# EasyEDA Pro project ProProject_mp3主板_2024-08-05.epro

# Schematic Schematic1
Create Date: 2024-07-17; Page Name: P1; Project Name: mp3主板; Schematic Name: Schematic1; Update Date: 2024-07-25; Company: 嘉立创EDA; Page Size: A4; Version: V1.0
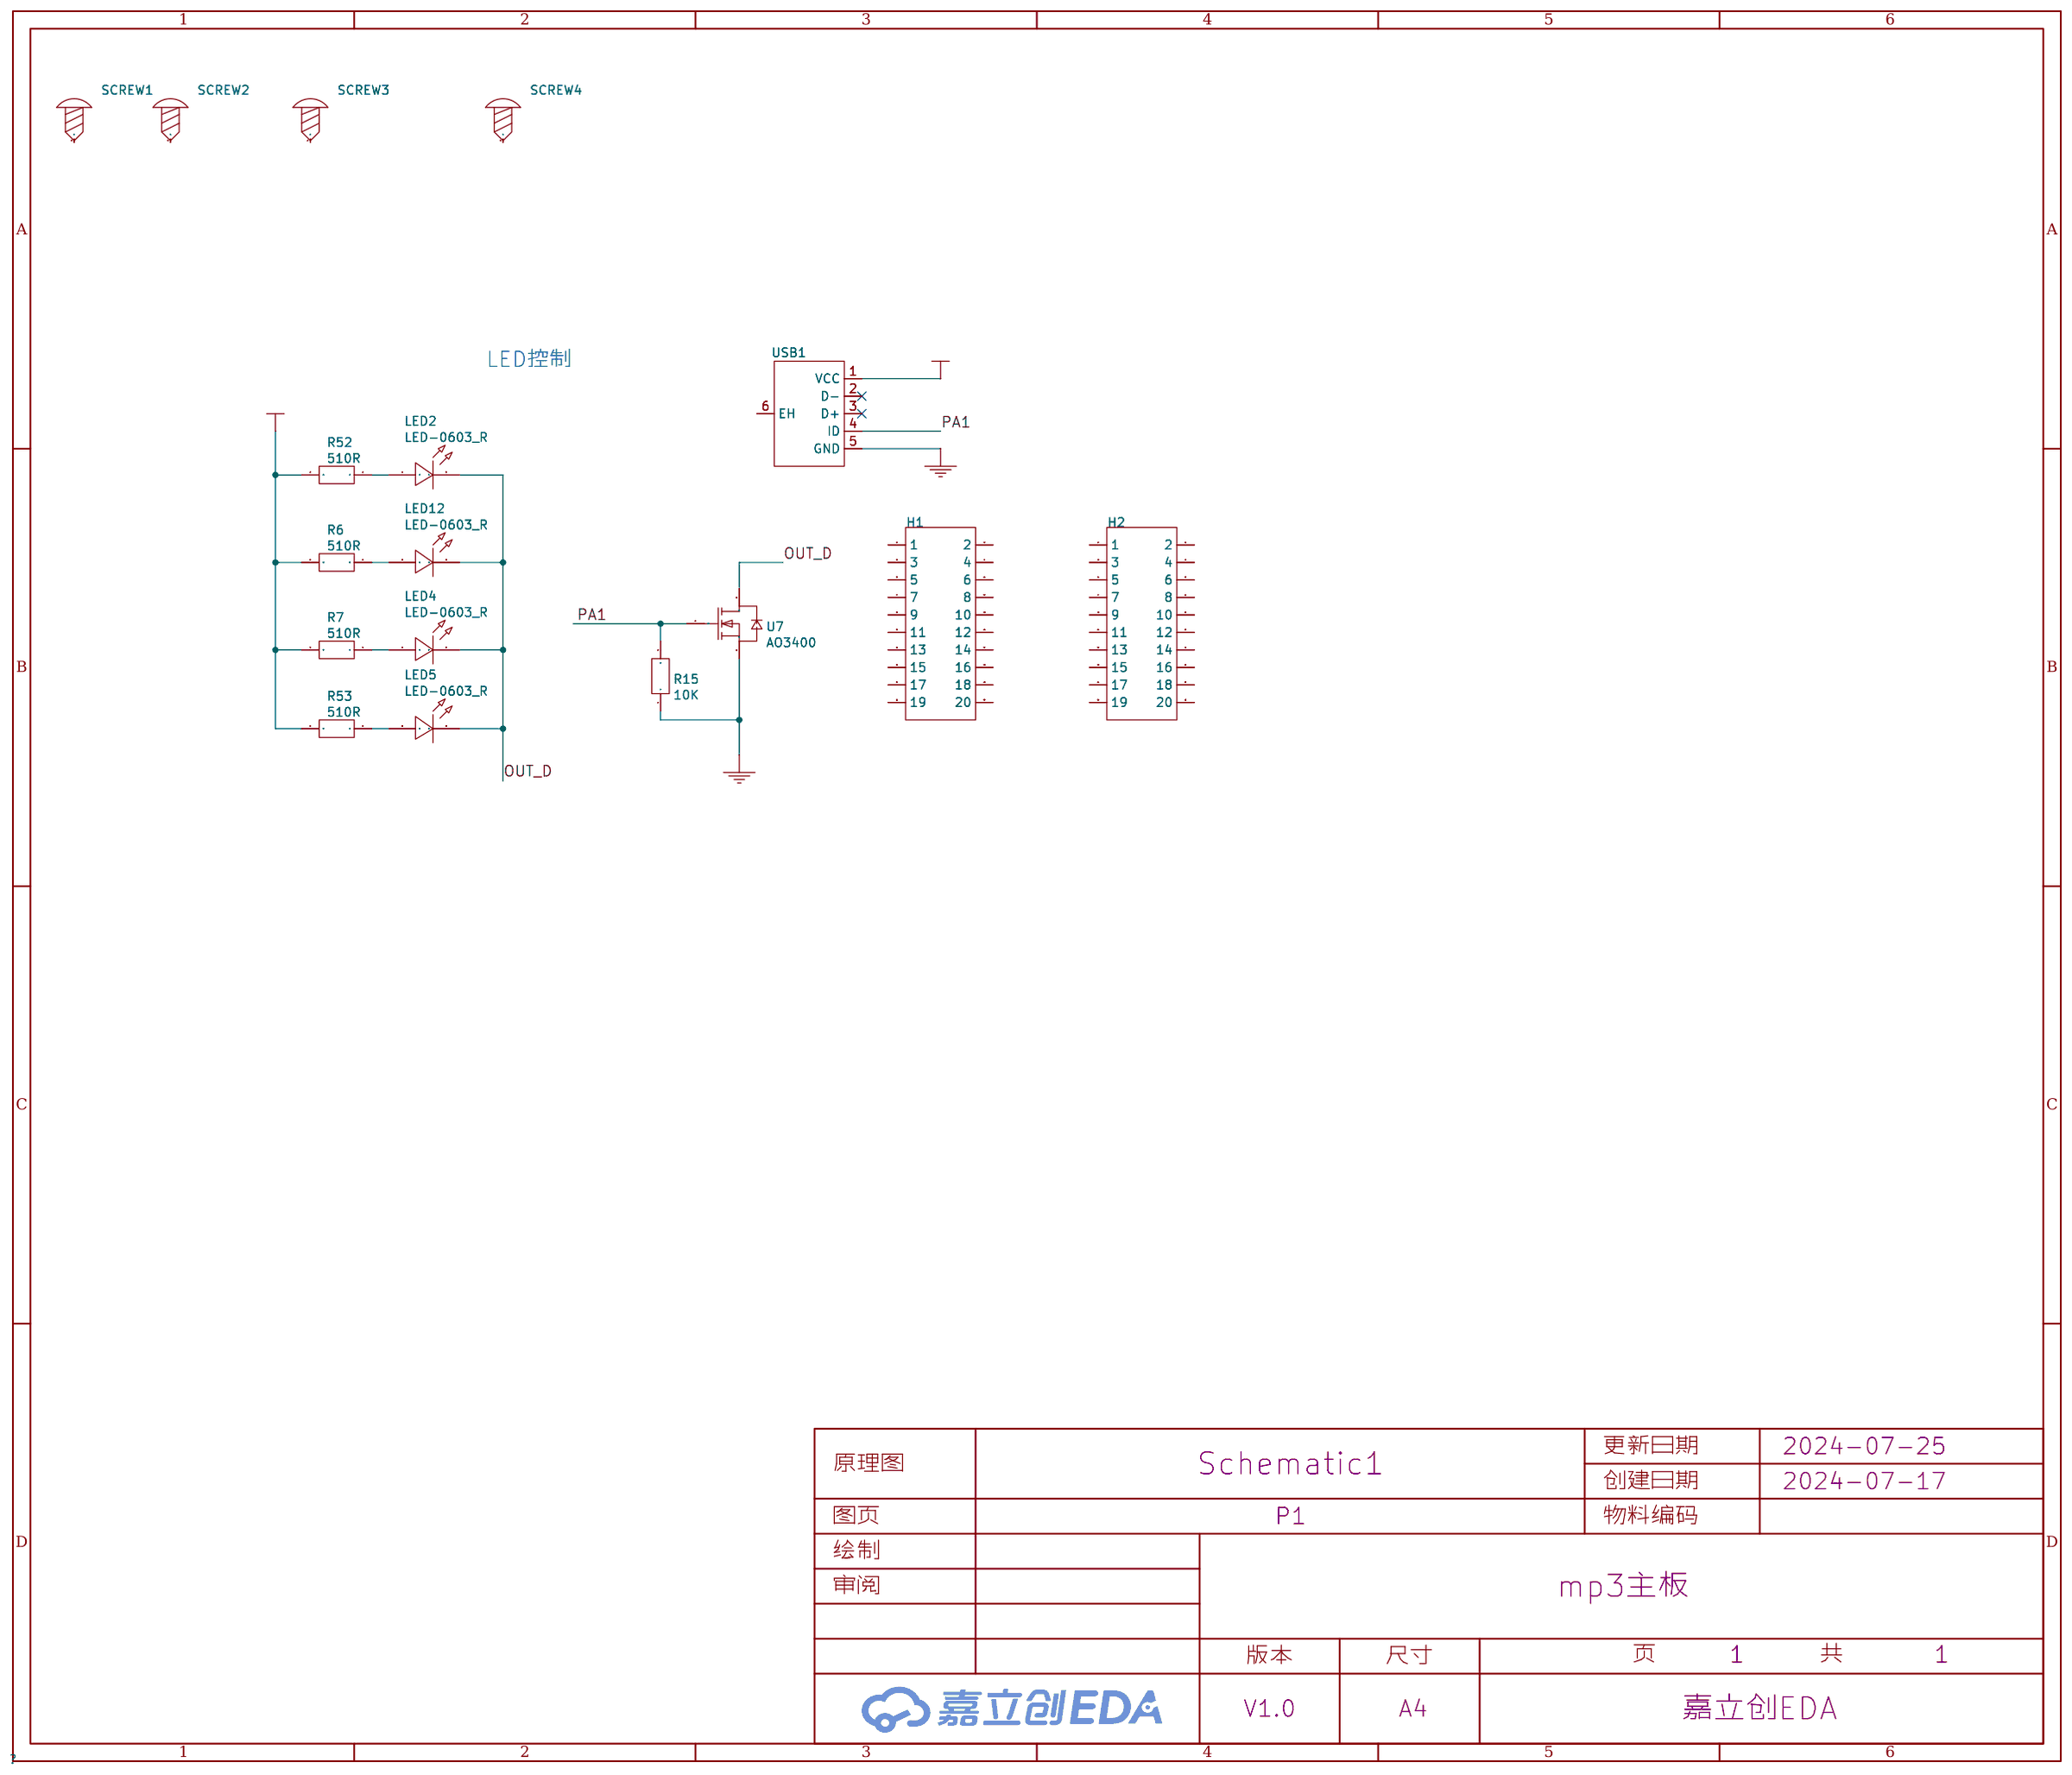
[diagram p0: schematic sheet]

## Parts
H1  -  [HDR-TH_20P-P2.54-V-R2-C10-S2.54]
H2  -  [HDR-TH_20P-P2.54-V-R2-C10-S2.54]
LED2  LED-0603_R  [footprint_5b50]
LED4  LED-0603_R  [footprint_5b50]
LED5  LED-0603_R  [footprint_5b50]
LED12  LED-0603_R  [footprint_5b50]
R6  510R  [footprint_4dfc]
R7  510R  [footprint_4dfc]
R15  10K  [footprint_4dfc]
R52  510R  [footprint_4dfc]
R53  510R  [footprint_4dfc]
SCREW1  -  [M3螺丝]
SCREW2  -  [M3螺丝]
SCREW3  -  [M3螺丝]
SCREW4  -  [M3螺丝]
U7  AO3400  [footprint_8e82]
USB1  -  [USB_Micro]

## Library data of the parts
H1 H2 = HDR-F_2.54_2x10: Supplier Part: C30867; Supplier Footprint: 插件
LED2 LED4 LED5 LED12 = LED-0603_R: Manufacturer: EVERLIGHT(台湾亿光); Manufacturer Part: 19-217/R6C-AL1M2VY/3T; Supplier Part: C72044; Supplier: LCSC
R6 R7 R52 R53 = 510R
R15 = 10K
SCREW1-SCREW4 = M3螺丝: Supplier Footprint: 插件
U7 = AO3400: Supplier: LCSC; Supplier Part: C5224189; Manufacturer: ElecSuper(静芯微）; JLCPCB Part Class: Extended Part; link: https://so.szlcsc.com/global.html?k=C5224189&amp;ref=editor
USB1 = USB_Micro-B: Supplier Footprint: SMD

## Nets
3.3V: R6.2 R7.2 R52.2 R53.2 USB1.1(VCC)
GND: R15.1 U7.2(S) USB1.5(GND)
OUT_D: LED2.2 LED4.2 LED5.2 LED12.2 U7.3(D)
PA1: R15.2 U7.1(G) USB1.4(ID)
$1N3626: LED2.1 R52.1
$1N3627: LED12.1 R6.1
$1N3628: LED4.1 R7.1
$1N3629: LED5.1 R53.1

Not connected (* = marked no-connect by the designer): H1 1 2 3 4 5 6 7 8 9 10 11 12 13 14 15 16 17 18 19 20; H2 1 2 3 4 5 6 7 8 9 10 11 12 13 14 15 16 17 18 19 20; SCREW1 1; SCREW2 1; SCREW3 1; SCREW4 1; USB1 2(D-)* 3(D+)* 6(EH)

## Notes on the sheet
- LED控制

# Board PCB1
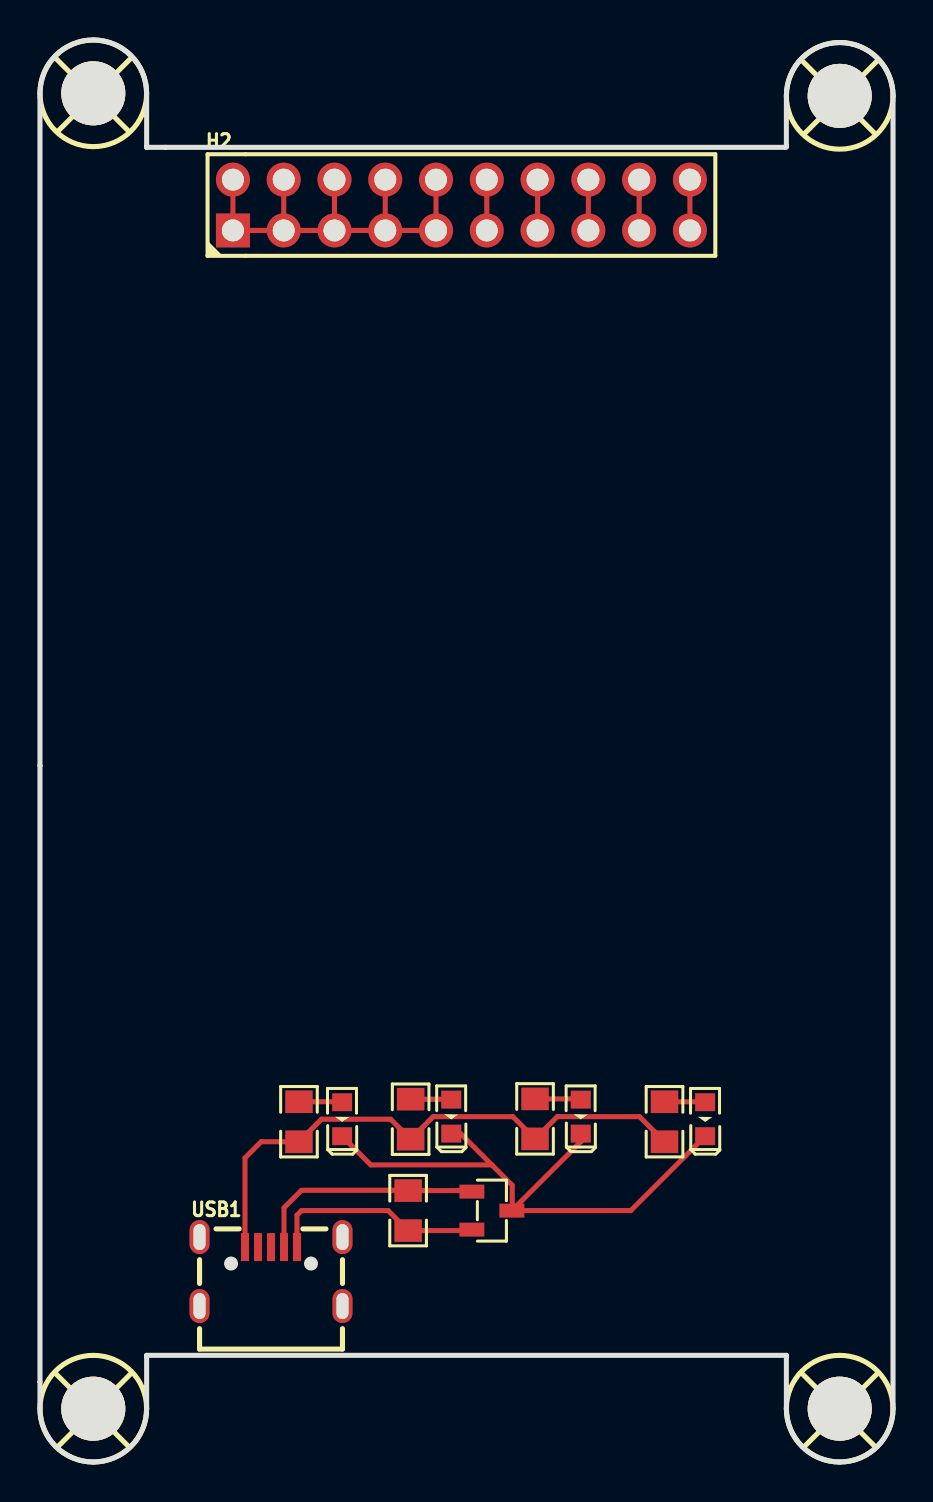
[diagram p1: board, top side]
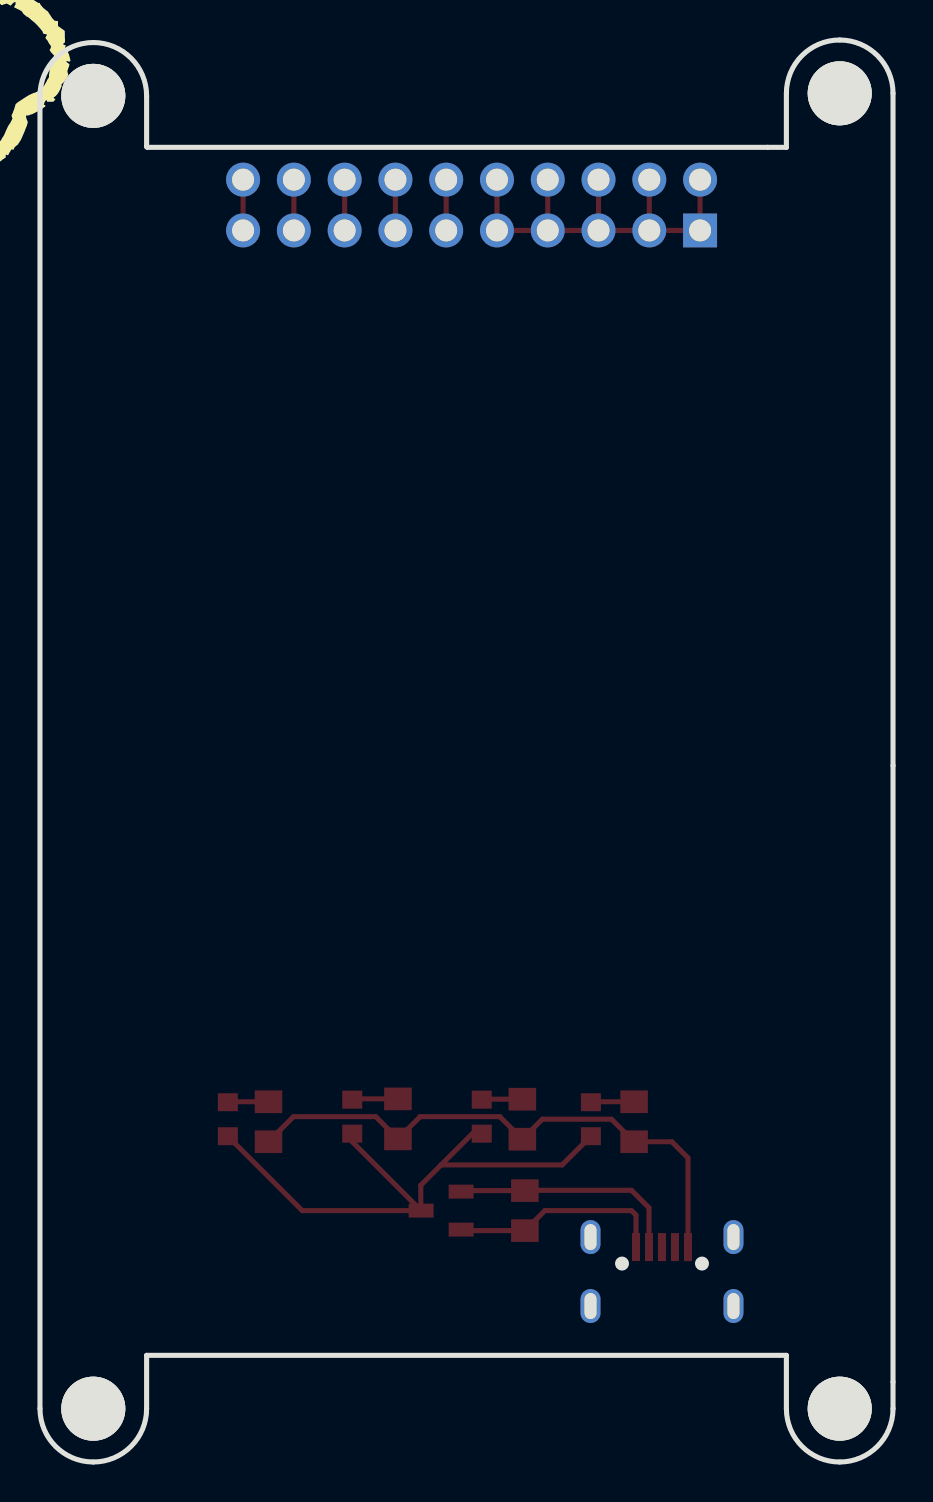
[diagram p2: board, bottom side, seen from below]

Outline 42.67 x 71.12 mm; copper layers: Top Layer, Bottom Layer. Coordinates in mm from the lower left corner of the outline.
Outline path: 0,68.45 arc(0.78,70.34) 2.67,71.12 arc(4.55,70.34) 5.33,68.45 5.33,65.75 37.3,65.75 arc(37.33,65.76) 37.34,65.79 37.34,68.33 arc(38.12,70.21) 40,70.99 arc(41.89,70.21) 42.67,68.33 42.67,2.67 arc(41.89,0.78) 40,0 arc(38.12,0.78) 37.34,2.67 37.34,5.33 5.33,5.33 5.33,2.67 arc(4.55,0.78) 2.67,0 arc(0.78,0.78) 0,2.67 0,68.45
Stack: Top Layer 0.035mm / Dielectric1 1.51mm FR4 er 4.5 / Bottom Layer 0.035mm

## Design rules (mm)
template: JLCPCB Capability(Two Layers Board)
spacing copperThickness1oz (default): track to track 0.102, other pairs 0.152 to 0.3
spacing copperThickness2oz: track to track 0.203, other pairs 0.152 to 0.3
track width copperThickness1oz (default): min 0.127, default 0.254, max 2.54
track width copperThickness2oz: min 0.203, default 0.254, max 2.54
differential pair differentialPair (default): width min 0.127, default 0.254, max 2.54; gap min 0.152, default 0.152
via viaSize (default): diameter min 0.5, default 0.61, max 10; hole min 0.3, default 0.305, max 6.3

## Placement (name value [footprint] x y rotation side)
H2  -  [HDR-TH_20P-P2.54-V-R2-C10-S2.54]  21.08 62.87 0 top
LED2  LED-0603_R  [footprint_5b50]  33.27 17.15 270 top
LED4  LED-0603_R  [footprint_5b50]  15.11 17.15 270 top
LED5  LED-0603_R  [footprint_5b50]  27.05 17.27 270 top
LED12  LED-0603_R  [footprint_5b50]  20.57 17.27 270 top
R6  510R  [footprint_4dfc]  18.54 17.15 270 top
R7  510R  [footprint_4dfc]  12.95 17.02 270 top
R15  10K  [footprint_4dfc]  18.41 12.57 90 top
R52  510R  [footprint_4dfc]  31.24 17.02 270 top
R53  510R  [footprint_4dfc]  24.76 17.16 270 top
SCREW1  -  [M3螺丝]  2.73 68.39 0 top
SCREW2  -  [M3螺丝]  40.07 68.26 0 top
SCREW3  -  [M3螺丝]  2.73 2.6 0 top
SCREW4  -  [M3螺丝]  40.07 2.6 0 top
U7  AO3400  [footprint_8e82]  22.61 12.57 180 top
USB1  -  [USB_Micro]  11.56 9.53 0 top

## Footprints (pads in the part's own frame, mm; a bottom-side part is the same pattern mirrored in y, then rotated)
footprint_4dfc
  rect 1.133x1.377 smd: 1(-1,0) 2(1,0)
footprint_5b50
  rect 0.9x1 smd: 1(-0.85,0) 2(0.85,0)
footprint_8e82
  rect 1.25x0.7 smd: 1(1,-0.95) 2(1,0.95) 3(-1,0)
HDR-TH_20P-P2.54-V-R2-C10-S2.54
  rect 1.7x1.7 hole 1.1: 1(-11.43,-1.27)
  round 1.7 hole 1.1: 2(-11.43,1.27) 3(-8.89,-1.27) 4(-8.89,1.27) 5(-6.35,-1.27) 6(-6.35,1.27) 7(-3.81,-1.27) 8(-3.81,1.27) 9(-1.27,-1.27) 10(-1.27,1.27) 11(1.27,-1.27) 12(1.27,1.27) 13(3.81,-1.27) 14(3.81,1.27) 15(6.35,-1.27) 16(6.35,1.27) 17(8.89,-1.27) 18(8.89,1.27) 19(11.43,-1.27) 20(11.43,1.27)
M3螺丝
  round 3.2 hole 3.2: 1(-0.064,0.064)
USB_Micro
  rect 0.4x1.4 smd: 1(-1.3,1.225) 2(-0.65,1.225) 3(0,1.225) 4(0.65,1.225) 5(1.3,1.225)
  oval 1x1.7 hole 0.6x1.3: 6(-3.575,1.725) 6(-3.575,-1.725) 6(3.575,1.725) 6(3.575,-1.725)

## Nets
As in the schematic.

Pads without a net: H2 1 2 3 4 5 6 7 8 9 10 11 12 13 14 15 16 17 18 19 20; SCREW1 1; SCREW2 1; SCREW3 1; SCREW4 1; USB1 2 3 6

## Routing (per net, layer and track width the routed paths; a pad name or vN(x,y) marks a point on that pad's centre or on a via; arc(x,y) is an arc through that point)
3.3V: length 28.6
  Top Layer w0.254: USB1.1 10.26,15.21 11.06,16.02 R7.2 14.08,17.15 17.54,17.15 R6.2 19.67,17.27 23.65,17.27 R53.2 25.88,17.27 29.99,17.27 R52.2
GND: length 10.9
  Top Layer w0.254: 21.61,11.62 21.56,11.57 R15.1 17.41,12.57 13.08,12.57 12.86,12.35 USB1.5
(no net): length 35.6
  Top Layer w0.254: 12.19,61.59 9.65,61.59 H2.2 ; 12.19,61.59 H2.4 ; 12.19,61.59 14.73,61.59 ; 17.27,61.59 19.81,61.59 H2.10 ; 17.27,61.59 14.73,61.59 ; 17.27,61.59 H2.8 ; H2.12 22.35,61.59 ; 14.73,61.59 H2.6 ; H2.18 29.97,61.59 ; H2.20 32.51,61.59 ; H2.14 24.89,61.59 ; H2.16 27.43,61.59
OUT_D: length 29.9
  Top Layer w0.254: 22.61,14.86 16.55,14.86 LED4.2 ; 22.61,14.86 23.62,13.84 23.62,12.59 ; 22.61,14.86 21.04,16.42 LED12.2 ; LED5.2 27.05,16.02 23.62,12.59 ; 23.62,12.59 U7.3 29.55,12.57 LED2.2
PA1: length 11.8
  Top Layer w0.254: U7.1 21.56,13.57 R15.2 18.4,13.59 13.08,13.59 12.21,12.72 USB1.4
$1N3626: length 2
  Top Layer w0.254: R52.1 33.25,18.02 LED2.1
$1N3627: length 2
  Top Layer w0.254: LED12.1 20.55,18.15 R6.1
$1N3628: length 2.2
  Top Layer w0.254: LED4.1 15.09,18.02 R7.1
$1N3629: length 2.3
  Top Layer w0.254: R53.1 27.01,18.16 LED5.1
